# EAGLE design M602 (EAGLE 4.11)
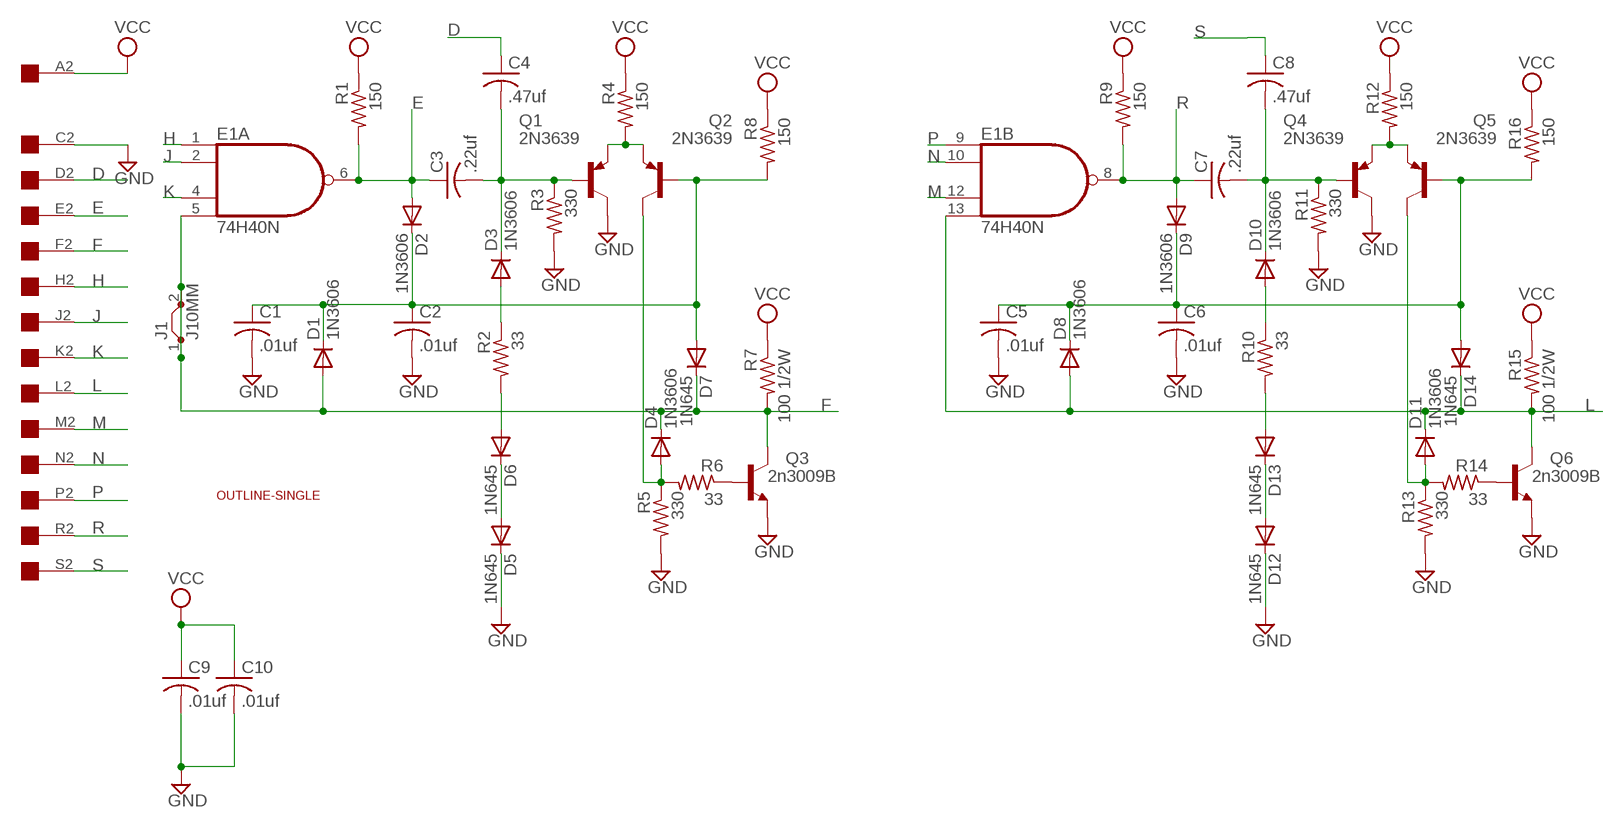
[diagram p0: schematic, sheet 1]

## Parts
C1  .01uf  C-US050-025X075  [C050-025X075]
C2  .01uf  C-US050-025X075  [C050-025X075]
C3  .22uf  C-US050-025X075  [C050-025X075]
C4  .47uf  C-US050-025X075  [C050-025X075]
C5  .01uf  C-US050-025X075  [C050-025X075]
C6  .01uf  C-US050-025X075  [C050-025X075]
C7  .22uf  C-US050-025X075  [C050-025X075]
C8  .47uf  C-US050-025X075  [C050-025X075]
C9  .01uf  C-US050-025X075  [C050-025X075]
C10  .01uf  C-US050-025X075  [C050-025X075]
D1  1N3606  1N4004  [DO41-10]
D2  1N3606  1N4004  [DO41-10]
D3  1N3606  1N4004  [DO41-10]
D4  1N3606  1N4004  [DO41-10]
D5  1N645  1N4004  [DO41-10]
D6  1N645  1N4004  [DO41-10]
D7  1N645  1N4004  [DO41-10]
D8  1N3606  1N4004  [DO41-10]
D9  1N3606  1N4004  [DO41-10]
D10  1N3606  1N4004  [DO41-10]
D11  1N3606  1N4004  [DO41-10]
D12  1N645  1N4004  [DO41-10]
D13  1N645  1N4004  [DO41-10]
D14  1N645  1N4004  [DO41-10]
E1  74H40N  74LS20N  [DIL14]
J1  J10MM  [10]
Q1  2N3639  2N5415  [TO39]
Q2  2N3639  2N5415  [TO39]
Q3  2n3009B  2N1711  [TO39]
Q4  2N3639  2N5415  [TO39]
Q5  2N3639  2N5415  [TO39]
Q6  2n3009B  2N1711  [TO39]
R1  150  R-US_0207/10  [0207/10]
R2  33  R-US_0207/10  [0207/10]
R3  330  R-US_0207/10  [0207/10]
R4  150  R-US_0207/10  [0207/10]
R5  330  R-US_0207/10  [0207/10]
R6  33  R-US_0207/10  [0207/10]
R7  100 1/2W  R-US_0207/10  [0207/10]
R8  150  R-US_0207/10  [0207/10]
R9  150  R-US_0207/10  [0207/10]
R10  33  R-US_0207/10  [0207/10]
R11  330  R-US_0207/10  [0207/10]
R12  150  R-US_0207/10  [0207/10]
R13  330  R-US_0207/10  [0207/10]
R14  33  R-US_0207/10  [0207/10]
R15  100 1/2W  R-US_0207/10  [0207/10]
R16  150  R-US_0207/10  [0207/10]
U$1  EDGE-1  [EDGE-CON1]
U$2  OUTLINE-SINGLE  [SINGLE]

## Nets
D: C4.1 U$1.D2
E: C3.1 D2.A E1.6(A:O) R1.2 U$1.E2
F: D1.A D4.C D7.C E1.5(A:I3) J1.1 J1.2 Q3.3(C) R7.2 U$1.F2
GND: C1.2 C2.2 C5.2 C6.2 C9.2 C10.2 D5.C D12.C Q1.3(C) Q3.1(E) Q4.3(C) Q6.1(E) R3.2 R5.2 R11.2 R13.2 U$1.C2
H: E1.1(A:I0) U$1.H2
J: E1.2(A:I1) U$1.J2
K: E1.4(A:I2) U$1.K2
L: D8.A D11.C D14.C E1.13(B:I3) Q6.3(C) R15.2 U$1.L2
M: E1.12(B:I2) U$1.M2
N: E1.10(B:I1) U$1.N2
N$1: C1.1 C2.1 D1.C D2.C D7.A Q2.2(B) R8.2
N$2: D3.A R2.1
N$3: D10.A R10.1
N$4: C3.2 C4.2 D3.C Q1.2(B) R3.1
N$5: Q1.1(E) Q2.1(E) R4.2
N$6: D4.A Q2.3(C) R5.1 R6.2
N$7: Q3.2(B) R6.1
N$8: D6.A R2.2
N$9: D5.A D6.C
N$10: C7.2 C8.2 D10.C Q4.2(B) R11.1
N$11: C5.1 C6.1 D8.C D9.C D14.A Q5.2(B) R16.2
N$13: D13.A R10.2
N$14: D12.A D13.C
N$15: Q6.2(B) R14.1
N$16: Q4.1(E) Q5.1(E) R12.2
N$17: D11.A Q5.3(C) R13.1 R14.2
P: E1.9(B:I0) U$1.P2
R: C7.1 D9.A E1.8(B:O) R9.2 U$1.R2
S: C8.1 U$1.S2
VCC: C9.1 C10.1 R1.1 R4.1 R7.1 R8.1 R9.1 R12.1 R15.1 R16.1 U$1.A2
Unconnected: U$1.B2 U$1.T2 U$1.U2 U$1.V2

## Power pins joined to a net without a drawn wire
GND: E1.7(P:GND)
VCC: E1.14(P:VCC)

## Library data of the parts
C1-C10 = rcl:C-US: CAPACITOR, American symbol
D1-D14 = diode:1N4004: DIODE general purpose rectifier, 1 A
E1 = 74xx-us:74*20: Dual 4-input NAND gate
J1 = jumper:J: Bridge
Q1 Q2 Q4 Q5 = transistor-pnp:2N5415*: PNP Transistror
Q3 Q6 = transistor-npn:2N1711: NPN Transistor
R1-R16 = rcl:R-US_: RESISTOR, American symbol
U$1 = dec-con:EDGE-1: Single-Sided DEC Edge Connector -- (side 2)
U$2 = dec-con:OUTLINE-*: Board outlines for DEC boards.

## Board
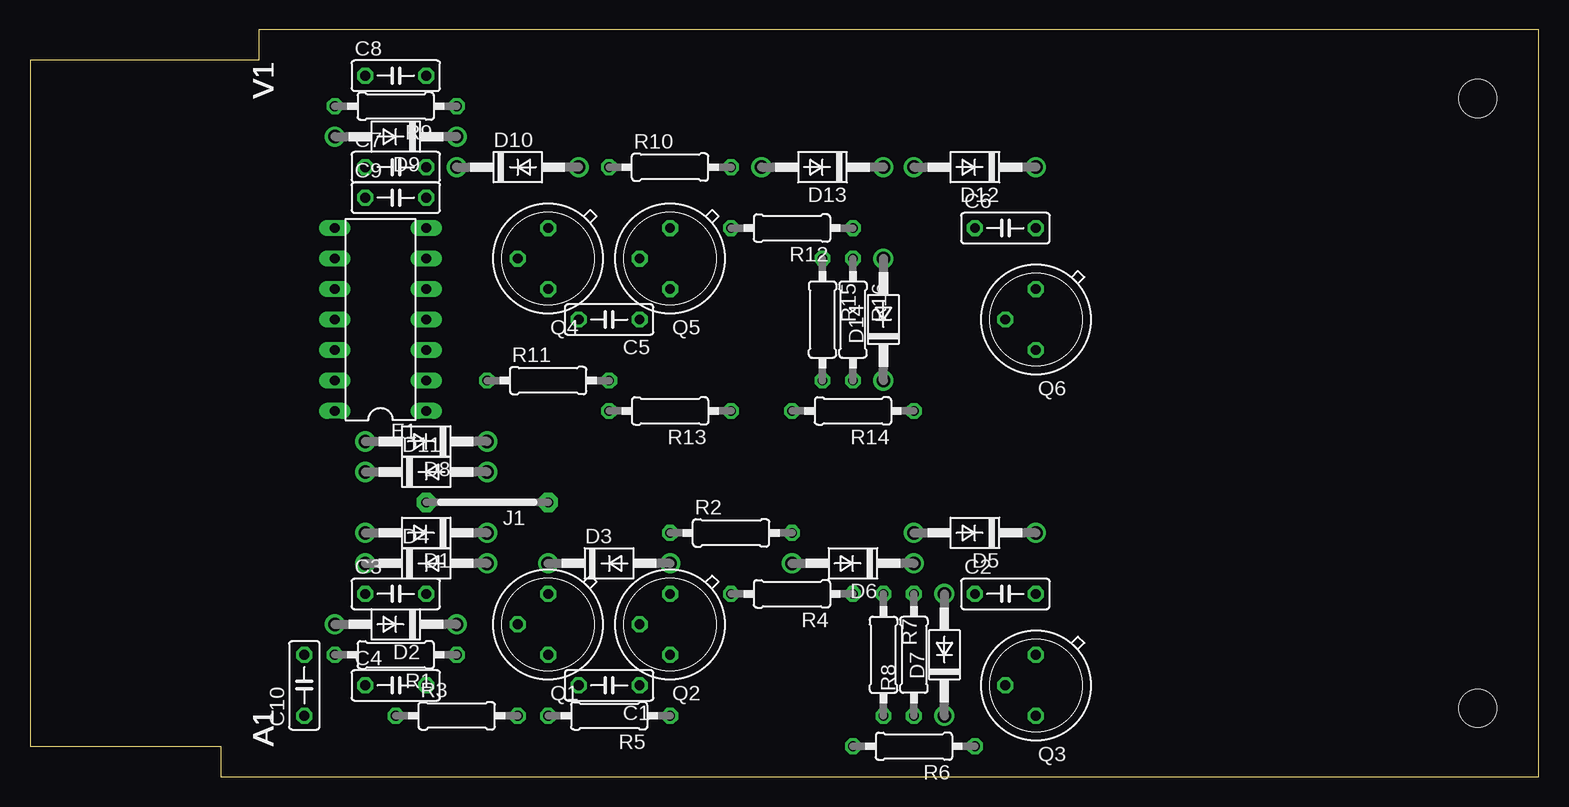
[diagram p1: board, top side]
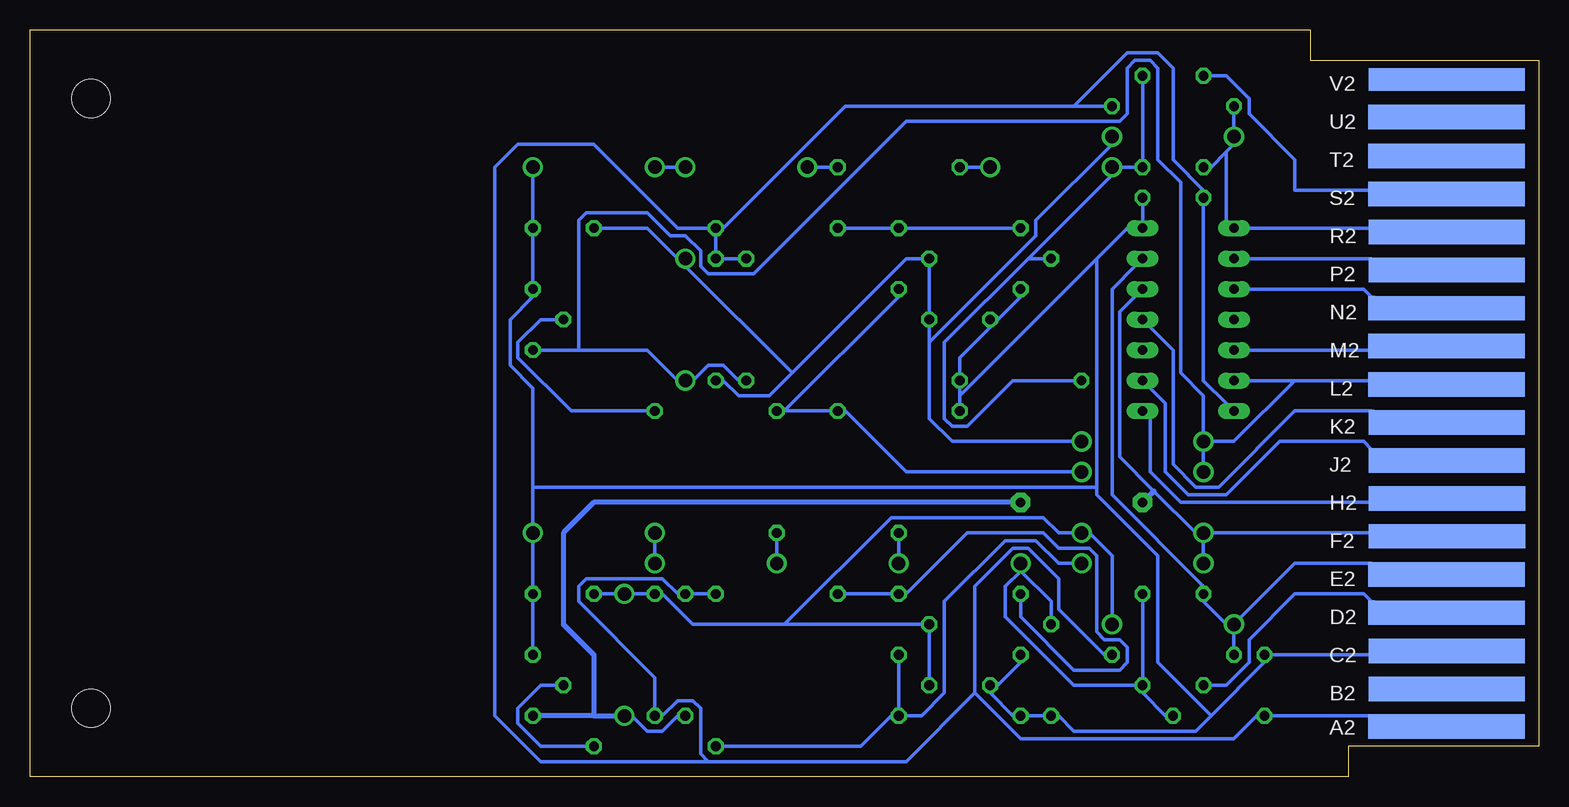
[diagram p2: board, bottom side, seen from below]

Size 125.73 x 62.23 mm. Coordinates in mm from the lower left corner, seen from the top.
Copper layers (1*16): Top 0.035mm / dielectric 1.5mm / Bottom 0.035mm
Design rules "10mils": minimum track width 12mil, minimum drill 28mil, track to track 10mil, track to pad 10mil, pad to pad 10mil, via to via 10mil, smd to smd 10mil, copper to edge 25mil, drill to drill 10mil, minimum pad ring 10mil, minimum via ring 8mil, stop-mask expansion 0mil, vias tented up to drill 0mil, thermal gap 10mil

### Footprints (pad centres in the part's own frame; a part is rotated, then mirrored left to right if it is on the bottom)
C050-025X075 = drill 0.813 octagon: 1 -2.54,0; 2 2.54,0
DO41-10 = drill 1.118 round: A 5.08,0; C -5.08,0
DIL14 = drill 0.813 long: 1 -7.62,-3.81; 2 -5.08,-3.81; 3 -2.54,-3.81; 4 0,-3.81; 5 2.54,-3.81; 6 5.08,-3.81; 7 7.62,-3.81; 8 7.62,3.81; 9 5.08,3.81; 10 2.54,3.81; 11 0,3.81; 12 -2.54,3.81; 13 -5.08,3.81; 14 -7.62,3.81
10 = drill 0.813 pad 1.6 octagon: 1 -5.08,0; 2 5.08,0
TO39 = drill 0.813 octagon: 1 0,-2.54; 2 2.54,0; 3 0,2.54
0207/10 = drill 0.813 octagon: 1 -5.08,0; 2 5.08,0
EDGE-CON1 = smd 13.017 x 2.032 bottom: A2 7.69,4.194; B2 7.668,7.328; C2 7.668,10.49; D2 7.693,13.665; E2 7.693,16.84; F2 7.642,20.041; H2 7.642,23.19; J2 7.668,26.34; K2 7.668,29.515; L2 7.693,32.69; M2 7.693,35.89; N2 7.693,39.04; P2 7.668,42.24; R2 7.668,45.39; S2 7.693,48.565; T2 7.693,51.74; U2 7.693,54.966 | smd 13.017 x 1.905 bottom: V2 7.668,58.102
SINGLE = hole 3.175: 120.65,56.515; 120.65,5.715

### Placement (x,y rotation side)
C1  48.26,7.62 180 top
C2  81.28,15.24 0 top
C3  30.48,15.24 0 top
C4  30.48,7.62 0 top
C5  48.26,38.1 180 top
C6  81.28,45.72 0 top
C7  30.48,50.8 0 top
C8  30.48,58.42 0 top
C9  30.48,48.26 0 top
C10  22.86,7.62 90 top
D1  33.02,20.32 180 top
D2  30.48,12.7 180 top
D3  48.26,17.78 0 top
D4  33.02,17.78 0 top
D5  78.74,20.32 180 top
D6  68.58,17.78 180 top
D7  76.2,10.16 90 top
D8  33.02,27.94 180 top
D9  30.48,53.34 180 top
D10  40.64,50.8 0 top
D11  33.02,25.4 0 top
D12  78.74,50.8 180 top
D13  66.04,50.8 180 top
D14  71.12,38.1 90 top
E1  29.21,38.1 90 top
J1  38.1,22.86 180 top
Q1  43.18,12.7 180 top
Q2  53.34,12.7 180 top
Q3  83.82,7.62 180 top
Q4  43.18,43.18 180 top
Q5  53.34,43.18 180 top
Q6  83.82,38.1 180 top
R1  30.48,10.16 180 top
R2  58.42,20.32 0 top
R3  35.56,5.08 0 top
R4  63.5,15.24 180 top
R5  48.26,5.08 180 top
R6  73.66,2.54 180 top
R7  71.12,10.16 270 top
R8  73.66,10.16 90 top
R9  30.48,55.88 180 top
R10  53.34,50.8 0 top
R11  43.18,33.02 0 top
R12  63.5,45.72 180 top
R13  53.34,30.48 180 top
R14  68.58,30.48 180 top
R15  66.04,38.1 270 top
R16  68.58,38.1 270 top
U$1  0,0 0 top
U$2  0,0 0 top

### Tracks (layer width: path | path; a pad name or v marks a point on that pad's centre or on a via)
D
  Bottom 0.305: C4.1 27.31,7.62 26.04,7.62 24.13,9.53 24.13,11.43 20.32,15.24 14.61,15.24 13.97,14.61 U$1.D2
E
  Bottom 0.305: R1.2 25.4,10.79 25.4,12.06 D2.A | D2.A 26.04,12.7 27.94,14.61 C3.1 27.94,15.88 35.56,23.5 35.56,40.64 33.66,42.55 E1.6 | D2.A 20.32,17.78 13.97,17.78 U$1.E2
F
  Top 0.406: J1.2 J1.1
  Bottom 0.305: R7.2 71.76,5.08 73.03,3.81 74.3,3.81 75.57,5.08 D7.C | D1.A 27.31,20.32 20.32,20.32 13.97,20.32 U$1.F2 | E1.5 33.66,40.01 34.93,38.73 34.93,26.67 32.07,23.81 28.58,20.32 D1.A | D4.C 27.94,18.41 27.94,19.68 D1.A
  Bottom 0.406: 78.74,5.08 78.74,10.16 81.28,12.7 81.28,20.32 78.74,22.86 J1.1 | 32.07,23.81 32.26,23.62 J1.2 | 78.74,5.08 D7.C | 78.74,5.08 Q3.3
GND
  Bottom 0.305: Q3.1 83.82,10.79 83.82,14.61 C2.2 83.82,15.88 83.82,19.68 D5.C 83.82,20.95 83.82,23.5 83.82,24.13 | D12.C 83.82,50.16 83.82,46.35 C6.2 83.82,45.09 83.82,41.27 Q6.1 83.82,40.01 85.73,38.1 85.73,34.29 83.82,32.38 83.82,24.13 | Q1.3 43.18,9.53 45.09,7.62 C1.2 45.72,6.99 43.82,5.08 R5.2 42.55,5.08 41.28,5.08 R3.2 40.01,5.08 38.74,3.81 28.58,3.81 27.31,5.08 | 27.31,5.08 22.86,9.53 C10.2 22.23,10.16 20.32,10.16 13.97,10.16 U$1.C2 | C9.2 33.02,47.62 33.02,46.35 E1.7 34.29,45.72 36.83,43.18 | 48.26,31.75 48.26,32.38 R11.2 48.26,33.66 48.26,34.92 45.72,37.47 C5.2 45.09,38.1 43.18,40.01 Q4.3 | 48.26,31.75 48.26,31.11 R13.2 | 36.83,43.18 48.26,31.75 | 27.31,5.08 31.75,9.53 31.75,18.41 36.83,23.5 36.83,24.13 | 36.83,24.13 36.83,43.18 | 36.83,24.13 83.82,24.13
H
  Bottom 0.305: E1.1 32.39,29.84 32.39,25.4 29.85,22.86 20.32,22.86 13.97,22.86 U$1.H2
J
  Bottom 0.305: E1.2 32.39,32.38 31.12,31.11 31.12,25.4 29.21,23.5 26.04,23.5 21.59,27.94 20.32,27.94 14.61,27.94 13.97,27.3 U$1.J2
K
  Bottom 0.305: E1.4 32.39,37.47 30.48,35.56 30.48,26.04 28.58,24.13 26.67,24.13 20.32,30.48 13.97,30.48 U$1.K2
L
  Bottom 0.305: D11.C 27.94,26.04 27.94,27.3 D8.A | 20.32,33.02 24.13,33.02 E1.13 | 20.32,33.02 25.4,27.94 27.31,27.94 D8.A | R15.2 66.68,33.02 67.95,34.29 69.22,34.29 70.49,33.02 D14.C 71.76,33.02 74.3,35.56 80.01,35.56 | 80.01,35.56 83.19,35.56 Q6.3 | 80.01,35.56 80.01,46.35 79.38,46.99 74.3,46.99 72.39,45.09 71.12,45.09 69.85,43.81 69.85,42.55 69.22,41.91 65.41,41.91 52.71,54.61 34.93,54.61 34.29,55.24 34.29,59.05 33.66,59.69 32.39,59.69 31.75,59.05 31.75,51.44 29.85,49.53 29.85,33.66 27.94,31.75 27.94,28.57 D8.A | 20.32,33.02 13.97,33.02 U$1.L2
M
  Bottom 0.305: E1.12 24.13,35.56 20.32,35.56 13.97,35.56 U$1.M2
N
  Bottom 0.305: E1.10 24.13,40.64 20.32,40.64 14.61,40.64 13.97,40.01 U$1.N2
N$1
  Bottom 0.305: D2.C 35.56,13.34 35.56,18.41 37.47,20.32 D1.C 38.74,20.32 40.01,20.32 41.28,21.59 53.98,21.59 62.87,12.7 | C1.1 50.8,8.26 50.8,12.06 Q2.2 51.44,12.7 62.87,12.7 | C2.1 78.11,15.24 76.84,15.24 D7.A 75.57,15.24 74.3,15.24 R8.2 73.03,15.24 70.49,12.7 62.87,12.7
N$2
  Bottom 0.305: R2.1 53.34,19.68 53.34,18.41 D3.A
N$3
  Bottom 0.305: R10.1 47.63,50.8 46.36,50.8 D10.A
N$4
  Bottom 0.305: 43.18,17.14 40.64,14.61 40.64,13.34 Q1.2 | 43.18,17.14 D3.C 43.18,17.14 | R3.1 31.12,5.08 33.02,6.99 C4.2 | C3.2 33.02,14.61 33.02,8.26 C4.2 | 43.18,17.14 44.45,15.88 44.45,13.34 38.74,7.62 33.66,7.62 C4.2
N$5
  Bottom 0.305: Q1.1 43.18,14.61 43.18,13.34 38.74,8.89 34.93,8.89 34.29,9.53 34.29,10.79 34.93,11.43 36.2,11.43 36.83,12.06 36.83,18.41 37.47,19.05 40.01,19.05 41.28,20.32 47.63,20.32 52.71,15.24 Q2.1 53.98,15.24 57.79,15.24 R4.2
N$6
  Bottom 0.305: R5.1 53.34,5.71 53.34,9.53 Q2.3 | R6.2 67.95,2.54 56.52,2.54 53.98,5.08 R5.1 | D4.A 38.74,17.78 40.01,17.78 41.91,19.68 44.45,19.68 49.53,14.61 49.53,6.99 51.44,5.08 52.71,5.08 R5.1
N$7
  Bottom 0.305: R6.1 79.38,2.54 83.19,2.54 85.09,4.45 85.09,5.71 83.19,7.62 81.92,7.62 Q3.2
N$8
  Bottom 0.305: R2.2 63.5,19.68 63.5,18.41 D6.A
N$9
  Bottom 0.305: D6.C 73.66,18.41 73.66,19.68 D5.A
N$10
  Bottom 0.305: C8.2 33.02,57.78 33.02,51.44 C7.2 33.66,50.8 34.93,50.8 D10.C 35.56,50.16 42.55,43.18 | 42.55,43.18 49.53,36.2 49.53,29.84 48.9,29.21 47.63,29.21 43.82,33.02 38.74,33.02 R11.1 | 42.55,43.18 41.28,43.18 Q4.2
N$11
  Bottom 0.305: C6.1 78.11,45.72 74.3,45.72 71.76,43.18 D14.A 71.12,42.55 62.23,33.66 | 62.23,33.66 52.71,43.18 51.44,43.18 Q5.2 50.8,42.55 50.8,38.73 C5.1 50.8,37.47 50.8,36.2 | 62.23,33.66 64.14,31.75 66.68,31.75 67.95,33.02 R16.2 | 50.8,36.2 50.8,29.84 48.9,27.94 38.74,27.94 D8.C | 50.8,36.2 41.91,45.09 41.91,46.35 35.56,52.7 D9.C
N$13
  Bottom 0.305: R10.2 59.06,50.8 60.33,50.8 D13.A
N$14
  Bottom 0.305: D13.C 71.76,50.8 73.03,50.8 D12.A
N$15
  Bottom 0.305: R14.1 74.3,30.48 80.65,30.48 85.09,34.92 85.09,36.2 83.19,38.1 81.92,38.1 Q6.2
N$16
  Bottom 0.305: Q4.1 43.82,45.72 52.71,45.72 Q5.1 53.98,45.72 57.79,45.72 R12.2
N$17
  Bottom 0.305: 62.87,30.48 59.06,30.48 R13.1 57.79,30.48 52.71,25.4 38.74,25.4 D11.A | 62.87,30.48 R14.2 62.87,30.48 | 62.87,30.48 53.34,40.01 Q5.3
P
  Bottom 0.305: E1.9 24.13,43.18 20.32,43.18 13.97,43.18 U$1.P2
R
  Bottom 0.305: 26.04,52.07 25.4,52.7 D9.A 25.4,53.98 25.4,55.24 R9.2 | 26.04,52.07 27.31,50.8 C7.1 | 26.04,52.07 26.04,46.35 E1.8 24.13,45.72 20.32,45.72 13.97,45.72 U$1.R2
S
  Bottom 0.305: C8.1 27.31,58.42 26.04,58.42 24.13,56.52 24.13,55.24 20.32,51.44 20.32,48.9 13.97,48.9 U$1.S2
VCC
  Bottom 0.305: E1.14 26.04,31.11 27.94,33.02 27.94,47.62 C9.1 27.94,48.9 30.48,51.44 30.48,59.05 31.75,60.33 34.29,60.33 38.74,55.88 | R15.1 66.68,43.18 67.95,43.18 R16.1 68.58,43.81 68.58,45.09 R12.1 | 38.74,55.88 57.79,55.88 67.95,45.72 R12.1 | 38.74,55.88 36.2,55.88 R9.1 | R4.1 69.22,15.24 70.49,15.24 R7.1 71.76,15.24 73.03,16.51 79.38,16.51 80.01,15.88 80.01,14.61 73.66,8.26 73.66,5.71 R8.1 73.03,5.08 71.76,6.35 70.49,6.35 69.85,5.71 69.85,1.91 69.22,1.27 | 46.99,6.99 46.99,15.88 43.82,19.05 42.55,19.05 40.01,16.51 40.01,13.97 36.2,10.16 R1.1 | 46.99,6.99 43.18,3.17 25.4,3.17 23.5,5.08 C10.1 22.23,5.08 20.32,5.08 13.97,5.08 U$1.A2 | 69.22,1.27 52.71,1.27 46.99,6.99 | 69.22,1.27 83.19,1.27 87,5.08 87,50.8 85.09,52.7 78.74,52.7 71.76,45.72 69.22,45.72 R12.1

### Text on the board
tNames: V1 | V1 | V1 | V1 | V1 | V1 | V1 | V1 | V1 | V1 | V1 | V1 | V1 | V1 | V1 | V1 | V1 | V1 | V1 | V1 | V1 | V1 | V1 | V1 | V1 | V1 | V1 | V1 | V1 | V1 | V1 | V1 | A1 | A1 | A1 | A1 | A1 | A1 | A1 | A1 | A1 | A1 | A1 | A1 | A1 | A1 | A1 | A1 | A1 | A1 | A1 | A1 | A1 | A1 | A1 | A1 | A1 | A1 | A1 | A1 | A1 | A1 | A1 | A1